# EAGLE schematic Battery_Li-Po_400mAh (EAGLE 6.5.0)
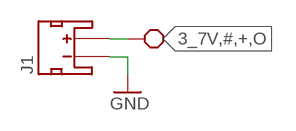
[diagram p0: schematic, sheet 1]

## Parts
J1  JST_2MM_MALE  [JST-2-SMD]

## Nets
3_7V,#,+,O: J1.2(+) ; supply symbol labelled BLOCK_REQUIREMENT
GND: J1.1(-)
Unconnected: J1.NC1(PAD1) J1.NC2(PAD2)

## Library data of the parts
J1 = SparkFun-Connectors:JST_2MM_MALE: Mates to single-cell LiPo batteries. CONN-08352; PROD_ID: CONN-08352